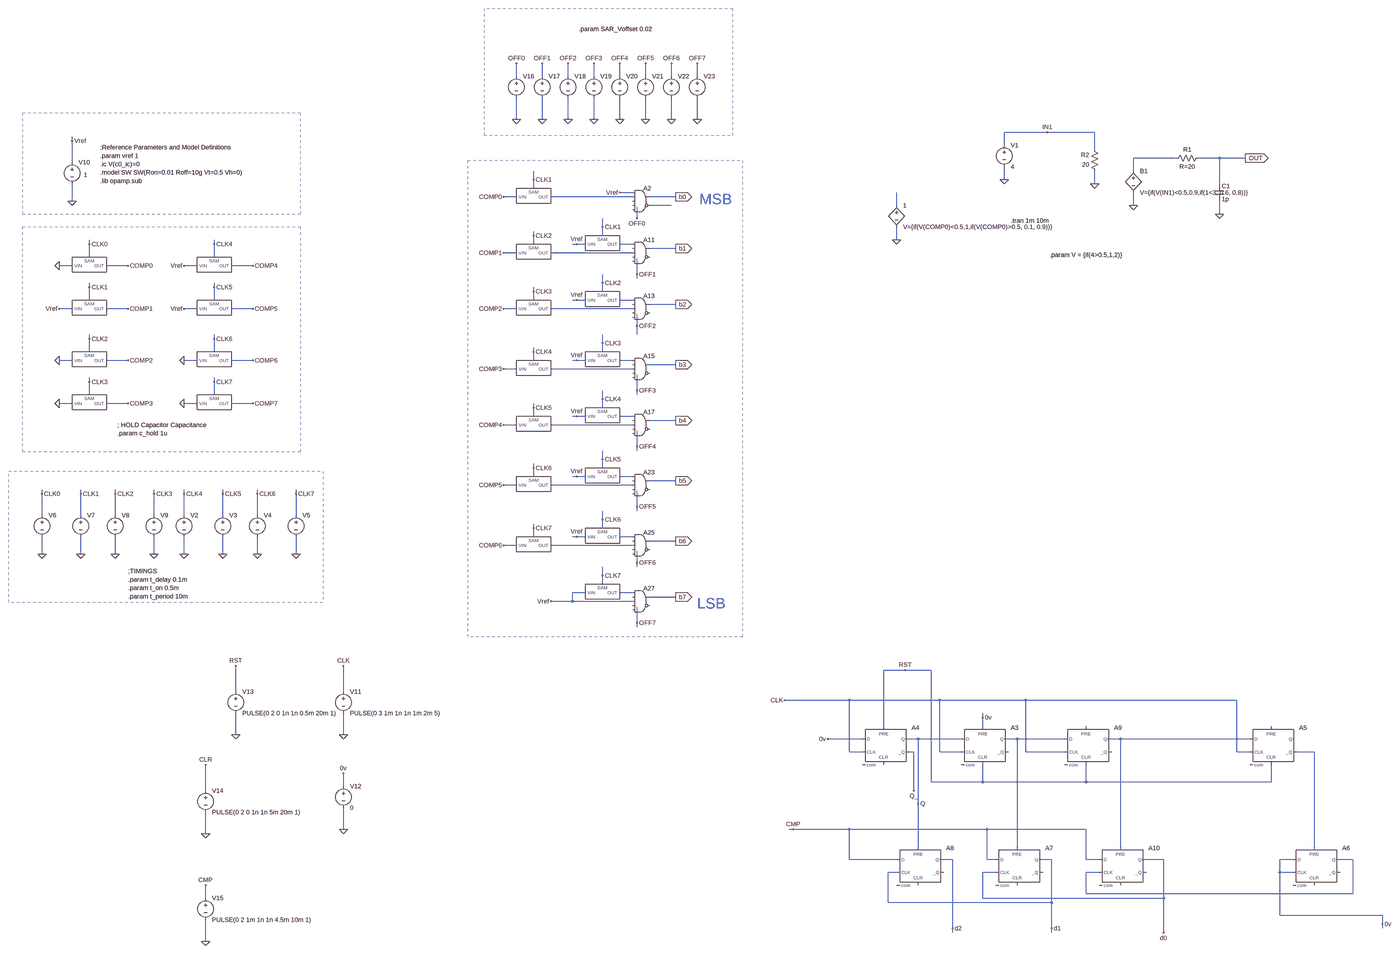
[diagram p0: schematic Draft2.asc, whole sheet]
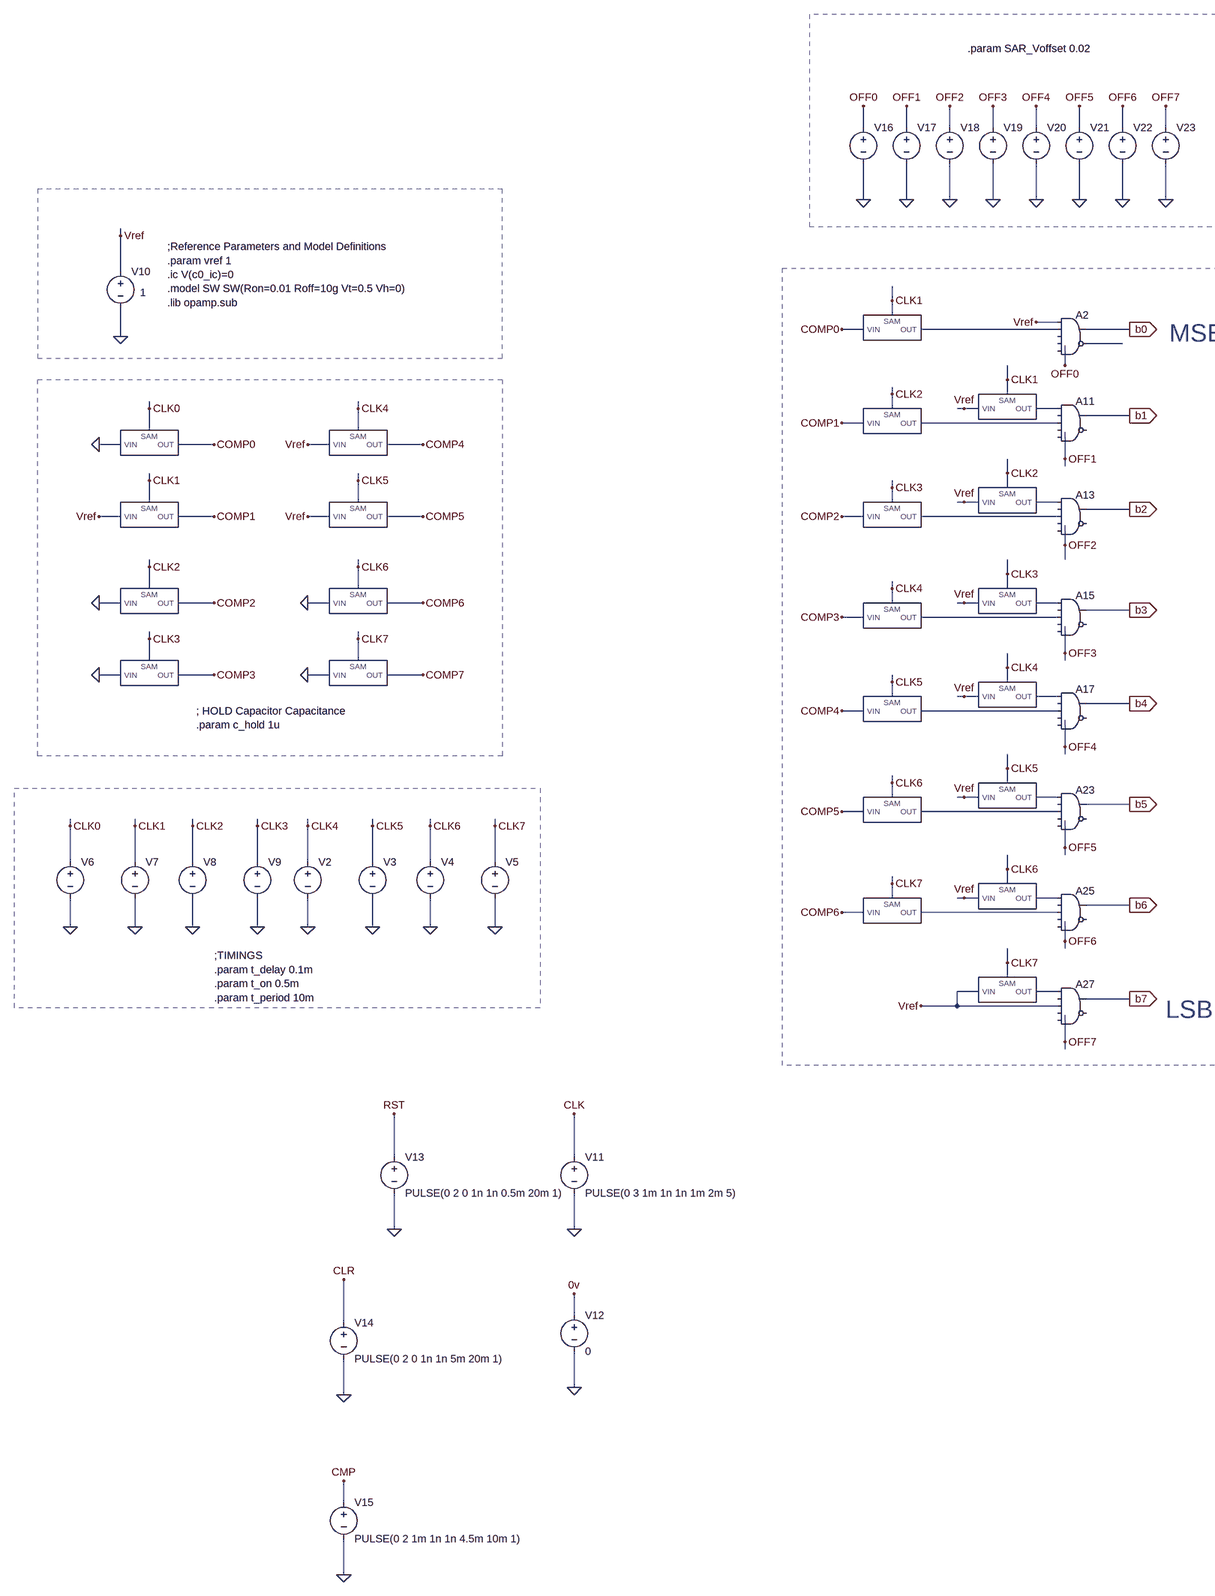
[diagram p1: schematic Draft2.asc, part, row 1 of 1, column 1 of 2]
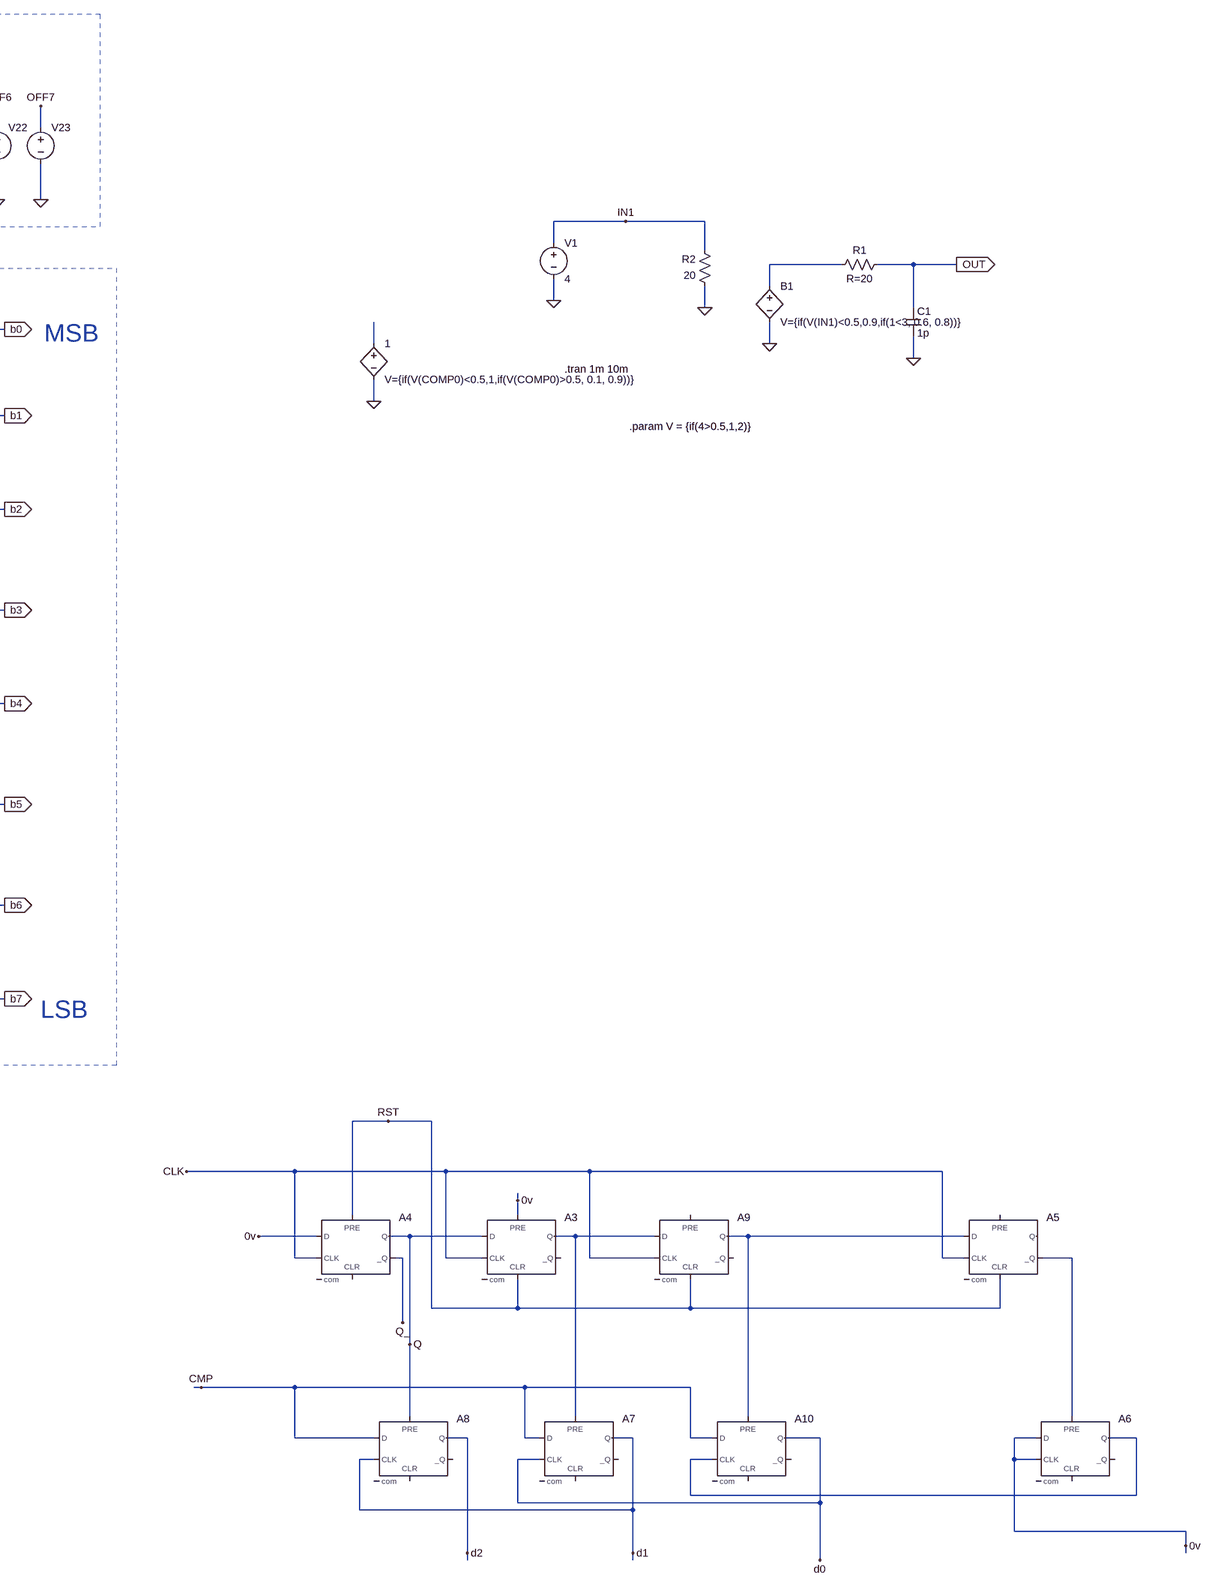
[diagram p2: schematic Draft2.asc, part, row 1 of 1, column 2 of 2]
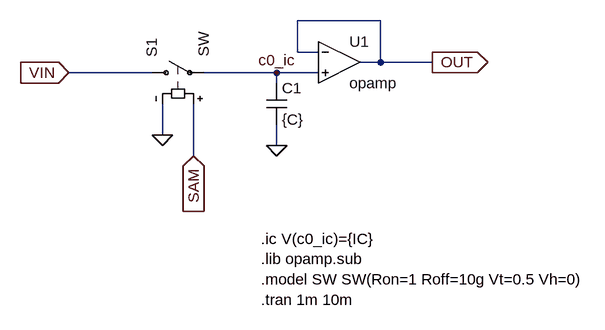
[diagram p3: sub-circuit com_sampleandhold.asc]
Draft2.asc, the LTspice schematic file:
Version 4
SHEET 1 4896 2624
WIRE 1312 -624 1312 -672
WIRE 1408 -624 1408 -672
WIRE 1504 -624 1504 -672
WIRE 1600 -624 1600 -672
WIRE 1696 -624 1696 -672
WIRE 1792 -624 1792 -672
WIRE 1888 -624 1888 -672
WIRE 1984 -624 1984 -672
WIRE 1312 -464 1312 -544
WIRE 1408 -464 1408 -544
WIRE 1504 -464 1504 -544
WIRE 1600 -464 1600 -544
WIRE 1696 -464 1696 -544
WIRE 1792 -464 1792 -544
WIRE 1888 -464 1888 -544
WIRE 1984 -464 1984 -544
WIRE 3568 -416 3408 -416
WIRE 3744 -416 3568 -416
WIRE -432 -384 -432 -400
WIRE 3408 -368 3408 -416
WIRE 3744 -352 3744 -416
WIRE 4048 -320 3888 -320
WIRE 4208 -320 4128 -320
WIRE 4304 -320 4208 -320
WIRE -432 -304 -432 -384
WIRE 3888 -272 3888 -320
WIRE 1376 -240 1376 -272
WIRE 3408 -240 3408 -288
WIRE 3744 -224 3744 -272
WIRE 4208 -224 4208 -320
WIRE 1376 -208 1376 -240
WIRE 1744 -192 1696 -192
WIRE 1312 -176 1264 -176
WIRE 1744 -176 1440 -176
WIRE 1904 -176 1808 -176
WIRE -432 -160 -432 -224
WIRE 1888 -144 1808 -144
WIRE 3008 -144 3008 -192
WIRE 3888 -144 3888 -192
WIRE 4208 -112 4208 -160
WIRE 1760 -96 1760 -128
WIRE 1632 -64 1632 -96
WIRE 1376 -32 1376 -48
WIRE 1632 -32 1632 -64
WIRE 3008 -16 3008 -64
WIRE -368 0 -368 -16
WIRE 96 0 96 -16
WIRE 1376 0 1376 -32
WIRE 1536 0 1520 0
WIRE 1568 0 1536 0
WIRE 1744 0 1696 0
WIRE 1904 16 1808 16
WIRE 1312 32 1264 32
WIRE 1744 32 1440 32
WIRE -368 48 -368 0
WIRE 96 48 96 0
WIRE -432 80 -480 80
WIRE -224 80 -304 80
WIRE 32 80 -16 80
WIRE 240 80 160 80
WIRE 1760 112 1760 64
WIRE 1760 128 1760 112
WIRE 1632 144 1632 112
WIRE -368 160 -368 144
WIRE 96 160 96 144
WIRE 1376 176 1376 160
WIRE 1632 176 1632 144
WIRE -368 208 -368 160
WIRE 96 208 96 160
WIRE 1376 208 1376 176
WIRE 1536 208 1520 208
WIRE 1568 208 1536 208
WIRE 1744 208 1696 208
WIRE 1904 224 1808 224
WIRE -432 240 -480 240
WIRE -224 240 -304 240
WIRE 32 240 -16 240
WIRE 240 240 160 240
WIRE 1312 240 1264 240
WIRE 1744 240 1440 240
WIRE 1760 304 1760 272
WIRE 1760 336 1760 304
WIRE -368 352 -368 336
WIRE 96 352 96 336
WIRE 1632 368 1632 336
WIRE -368 400 -368 352
WIRE 96 400 96 352
WIRE 1376 400 1376 384
WIRE 1632 400 1632 368
WIRE -432 432 -480 432
WIRE -224 432 -304 432
WIRE 32 432 -16 432
WIRE 240 432 160 432
WIRE 1376 432 1376 400
WIRE 1536 432 1520 432
WIRE 1568 432 1536 432
WIRE 1744 432 1696 432
WIRE 1904 448 1808 448
WIRE 1312 464 1264 464
WIRE 1744 464 1440 464
WIRE -368 512 -368 496
WIRE 96 512 96 496
WIRE 1760 544 1760 496
WIRE -368 560 -368 512
WIRE 96 560 96 512
WIRE 1760 560 1760 544
WIRE 1632 576 1632 544
WIRE -432 592 -480 592
WIRE -224 592 -304 592
WIRE 32 592 -16 592
WIRE 240 592 160 592
WIRE 1376 608 1376 592
WIRE 1632 608 1632 576
WIRE 1376 640 1376 608
WIRE 1536 640 1520 640
WIRE 1568 640 1536 640
WIRE 1744 640 1696 640
WIRE 1904 656 1808 656
WIRE 1312 672 1264 672
WIRE 1744 672 1440 672
WIRE 1760 752 1760 704
WIRE 1760 768 1760 752
WIRE 1632 800 1632 768
WIRE 1376 832 1376 816
WIRE 1632 832 1632 800
WIRE 1376 864 1376 832
WIRE 1536 864 1520 864
WIRE 1568 864 1536 864
WIRE 1744 864 1696 864
WIRE 1904 880 1808 880
WIRE 1312 896 1264 896
WIRE 1744 896 1440 896
WIRE -544 928 -544 912
WIRE -400 928 -400 912
WIRE -272 928 -272 912
WIRE -128 928 -128 912
WIRE -16 928 -16 912
WIRE 128 928 128 912
WIRE 256 928 256 912
WIRE 400 928 400 912
WIRE 1760 976 1760 928
WIRE 1760 992 1760 976
WIRE -544 1008 -544 928
WIRE -400 1008 -400 928
WIRE -272 1008 -272 928
WIRE -128 1008 -128 928
WIRE -16 1008 -16 928
WIRE 128 1008 128 928
WIRE 256 1008 256 928
WIRE 400 1008 400 928
WIRE 1632 1024 1632 992
WIRE 1376 1056 1376 1040
WIRE 1632 1056 1632 1024
WIRE 1376 1088 1376 1056
WIRE 1536 1088 1520 1088
WIRE 1568 1088 1536 1088
WIRE 1744 1088 1696 1088
WIRE 1904 1104 1808 1104
WIRE 1312 1120 1264 1120
WIRE 1744 1120 1440 1120
WIRE -544 1152 -544 1088
WIRE -400 1152 -400 1088
WIRE -272 1152 -272 1088
WIRE -128 1152 -128 1088
WIRE -16 1152 -16 1088
WIRE 128 1152 128 1088
WIRE 256 1152 256 1088
WIRE 400 1152 400 1088
WIRE 1760 1184 1760 1152
WIRE 1760 1200 1760 1184
WIRE 1632 1232 1632 1200
WIRE 1632 1264 1632 1232
WIRE 1568 1296 1520 1296
WIRE 1744 1296 1696 1296
WIRE 1904 1312 1808 1312
WIRE 1520 1328 1520 1296
WIRE 1520 1328 1440 1328
WIRE 1744 1328 1520 1328
WIRE 1760 1408 1760 1360
WIRE 1760 1424 1760 1408
WIRE 3040 1584 2960 1584
WIRE 3136 1584 3040 1584
WIRE 176 1664 176 1568
WIRE 576 1664 576 1568
WIRE 2832 1696 2592 1696
WIRE 3168 1696 2832 1696
WIRE 3488 1696 3168 1696
WIRE 4272 1696 3488 1696
WIRE 3328 1760 3328 1744
WIRE 2960 1792 2960 1584
WIRE 3328 1792 3328 1760
WIRE 176 1824 176 1744
WIRE 576 1824 576 1744
WIRE 2880 1840 2752 1840
WIRE 3088 1840 3040 1840
WIRE 3248 1840 3088 1840
WIRE 3456 1840 3408 1840
WIRE 3632 1840 3456 1840
WIRE 3840 1840 3792 1840
WIRE 4320 1840 3840 1840
WIRE 2832 1888 2832 1696
WIRE 2880 1888 2832 1888
WIRE 3072 1888 3056 1888
WIRE 3168 1888 3168 1696
WIRE 3248 1888 3168 1888
WIRE 3488 1888 3488 1696
WIRE 3632 1888 3488 1888
WIRE 4272 1888 4272 1696
WIRE 4320 1888 4272 1888
WIRE 4560 1888 4496 1888
WIRE 3136 2000 3136 1584
WIRE 3328 2000 3328 1936
WIRE 3328 2000 3136 2000
WIRE 3712 2000 3712 1936
WIRE 3712 2000 3328 2000
WIRE 4400 2000 4400 1936
WIRE 4400 2000 3712 2000
WIRE 576 2016 576 1968
WIRE 64 2032 64 1936
WIRE 3072 2032 3072 1888
WIRE 3088 2080 3088 1840
WIRE 576 2176 576 2096
WIRE 2624 2176 2608 2176
WIRE 2832 2176 2624 2176
WIRE 3344 2176 2832 2176
WIRE 3712 2176 3344 2176
WIRE 64 2192 64 2112
WIRE 3088 2240 3088 2080
WIRE 3456 2240 3456 1840
WIRE 3840 2240 3840 1840
WIRE 4560 2240 4560 1888
WIRE 2832 2288 2832 2176
WIRE 3008 2288 2832 2288
WIRE 3216 2288 3168 2288
WIRE 3344 2288 3344 2176
WIRE 3376 2288 3344 2288
WIRE 3584 2288 3536 2288
WIRE 3712 2288 3712 2176
WIRE 3760 2288 3712 2288
WIRE 4000 2288 3920 2288
WIRE 4480 2288 4432 2288
WIRE 4704 2288 4640 2288
WIRE 3008 2336 2976 2336
WIRE 3376 2336 3328 2336
WIRE 3760 2336 3712 2336
WIRE 4432 2336 4432 2288
WIRE 4480 2336 4432 2336
WIRE 3712 2416 3712 2336
WIRE 4704 2416 4704 2288
WIRE 4704 2416 3712 2416
WIRE 64 2432 64 2384
WIRE 3328 2432 3328 2336
WIRE 4000 2432 4000 2288
WIRE 4000 2432 3328 2432
WIRE 2976 2448 2976 2336
WIRE 3584 2448 3584 2288
WIRE 3584 2448 2976 2448
WIRE 4432 2496 4432 2336
WIRE 4880 2496 4432 2496
WIRE 4880 2528 4880 2496
WIRE 3216 2544 3216 2288
WIRE 3584 2544 3584 2448
WIRE 4880 2544 4880 2528
WIRE 3216 2560 3216 2544
WIRE 3584 2560 3584 2544
WIRE 4000 2560 4000 2432
WIRE 64 2592 64 2512
FLAG 3568 -416 IN1
FLAG 3888 -144 0
FLAG 4208 -112 0
FLAG 4304 -320 OUT
IOPIN 4304 -320 Out
FLAG 3408 -240 0
FLAG 3744 -224 0
FLAG -16 1152 0
FLAG -16 928 CLK4
FLAG 128 1152 0
FLAG 128 928 CLK5
FLAG 256 1152 0
FLAG 256 928 CLK6
FLAG 400 1152 0
FLAG 400 928 CLK7
FLAG -544 1152 0
FLAG -544 928 CLK0
FLAG -400 1152 0
FLAG -400 928 CLK1
FLAG -272 1152 0
FLAG -272 928 CLK2
FLAG -128 1152 0
FLAG -128 928 CLK3
FLAG -432 -160 0
FLAG -432 -384 Vref
FLAG -16 432 0
FLAG 96 352 CLK6
FLAG 240 432 COMP6
FLAG -16 592 0
FLAG 96 512 CLK7
FLAG 240 592 COMP7
FLAG -480 432 0
FLAG -368 352 CLK2
FLAG -224 432 COMP2
FLAG -480 592 0
FLAG -368 512 CLK3
FLAG -224 592 COMP3
FLAG -16 80 Vref
FLAG 96 0 CLK4
FLAG 240 80 COMP4
FLAG -16 240 Vref
FLAG 96 160 CLK5
FLAG 240 240 COMP5
FLAG -480 80 0
FLAG -368 0 CLK0
FLAG -224 80 COMP0
FLAG -480 240 Vref
FLAG -368 160 CLK1
FLAG -224 240 COMP1
FLAG 1904 -176 b0
IOPIN 1904 -176 Out
FLAG 1696 -192 Vref
FLAG 576 1824 0
FLAG 576 2176 0
FLAG 576 1968 0v
FLAG 2752 1840 0v
FLAG 576 1568 CLK
FLAG 2592 1696 CLK
FLAG 176 1824 0
FLAG 176 1568 RST
FLAG 3088 2080 Q
FLAG 3072 2032 Q_
FLAG 64 2192 0
FLAG 64 1936 CLR
FLAG 3040 1584 RST
FLAG 4880 2528 0v
FLAG 2624 2176 CMP
FLAG 64 2592 0
FLAG 64 2384 CMP
FLAG 3584 2544 d1
FLAG 3216 2544 d2
FLAG 3328 1760 0v
FLAG 4000 2560 d0
FLAG 1264 -176 COMP0
FLAG 1376 -240 CLK1
FLAG 3008 -16 0
FLAG 1904 16 b1
IOPIN 1904 16 Out
FLAG 1264 32 COMP1
FLAG 1376 -32 CLK2
FLAG 1632 -64 CLK1
FLAG 1904 224 b2
IOPIN 1904 224 Out
FLAG 1264 240 COMP2
FLAG 1376 176 CLK3
FLAG 1632 144 CLK2
FLAG 1904 448 b3
IOPIN 1904 448 Out
FLAG 1264 464 COMP3
FLAG 1376 400 CLK4
FLAG 1632 368 CLK3
FLAG 1904 656 b4
IOPIN 1904 656 Out
FLAG 1264 672 COMP4
FLAG 1376 608 CLK5
FLAG 1632 576 CLK4
FLAG 1904 880 b5
IOPIN 1904 880 Out
FLAG 1264 896 COMP5
FLAG 1376 832 CLK6
FLAG 1632 800 CLK5
FLAG 1904 1104 b6
IOPIN 1904 1104 Out
FLAG 1264 1120 COMP6
FLAG 1376 1056 CLK7
FLAG 1632 1024 CLK6
FLAG 1904 1312 b7
IOPIN 1904 1312 Out
FLAG 1632 1232 CLK7
FLAG 1536 0 Vref
FLAG 1536 208 Vref
FLAG 1536 432 Vref
FLAG 1536 640 Vref
FLAG 1536 864 Vref
FLAG 1536 1088 Vref
FLAG 1440 1328 Vref
FLAG 1312 -464 0
FLAG 1312 -672 OFF0
FLAG 1408 -464 0
FLAG 1408 -672 OFF1
FLAG 1504 -464 0
FLAG 1504 -672 OFF2
FLAG 1600 -464 0
FLAG 1600 -672 OFF3
FLAG 1696 -464 0
FLAG 1696 -672 OFF4
FLAG 1792 -464 0
FLAG 1792 -672 OFF5
FLAG 1888 -464 0
FLAG 1888 -672 OFF6
FLAG 1984 -464 0
FLAG 1984 -672 OFF7
FLAG 1760 -96 OFF0
FLAG 1760 112 OFF1
FLAG 1760 304 OFF2
FLAG 1760 544 OFF3
FLAG 1760 752 OFF4
FLAG 1760 976 OFF5
FLAG 1760 1184 OFF6
FLAG 1760 1408 OFF7
SYMBOL res 4144 -336 R90
WINDOW 0 0 56 VBottom 2
WINDOW 3 32 56 VTop 2
SYMATTR InstName R1
SYMATTR Value R=20
SYMBOL cap 4192 -224 R0
SYMATTR InstName C1
SYMATTR Value 1p
SYMBOL voltage 3408 -384 R0
SYMATTR InstName V1
SYMATTR Value 4
SYMBOL res 3760 -256 R180
WINDOW 0 36 76 Left 2
WINDOW 3 36 40 Left 2
SYMATTR InstName R2
SYMATTR Value 20
SYMBOL bv 3888 -288 R0
SYMATTR InstName B1
SYMATTR Value V={if(V(IN1)<0.5,0.9,if(1<3, 0.6, 0.8))}
SYMBOL voltage -16 992 R0
WINDOW 3 24 96 Invisible 2
SYMATTR Value PULSE(0 1 {t_delay+4*t_on} 1n 1n {t_on} {t_period} 1)
SYMATTR InstName V2
SYMBOL voltage 128 992 R0
WINDOW 3 24 96 Invisible 2
SYMATTR Value PULSE(0 1 {t_delay+5*t_on} 1n 1n {t_on} {t_period} 1)
SYMATTR InstName V3
SYMBOL voltage 256 992 R0
WINDOW 3 24 96 Invisible 2
SYMATTR Value PULSE(0 1 {t_delay+6*t_on} 1n 1n {t_on} {t_period} 1)
SYMATTR InstName V4
SYMBOL voltage 400 992 R0
WINDOW 3 24 96 Invisible 2
SYMATTR Value PULSE(0 1 {t_delay+7*t_on} 1n 1n {t_on} {t_period} 1)
SYMATTR InstName V5
SYMBOL voltage -544 992 R0
WINDOW 3 24 96 Invisible 2
SYMATTR Value PULSE(0 1 {t_delay} 1n 1n {t_on} {t_period} 1)
SYMATTR InstName V6
SYMBOL voltage -400 992 R0
WINDOW 3 24 96 Invisible 2
SYMATTR Value PULSE(0 1 {t_delay+t_on} 1n 1n {t_on} {t_period} 1)
SYMATTR InstName V7
SYMBOL voltage -272 992 R0
WINDOW 3 24 96 Invisible 2
SYMATTR Value PULSE(0 1 {t_delay+2*t_on} 1n 1n {t_on} {t_period} 1)
SYMATTR InstName V8
SYMBOL voltage -128 992 R0
WINDOW 3 24 96 Invisible 2
SYMATTR Value PULSE(0 1 {t_delay+3*t_on} 1n 1n {t_on} {t_period} 1)
SYMATTR InstName V9
SYMBOL voltage -432 -320 R0
WINDOW 3 50 62 Center 2
SYMATTR Value 1
SYMATTR InstName V10
SYMBOL COM_SampleAndHold 96 448 R0
WINDOW 0 0 -56 Invisible 2
WINDOW 39 0 0 Invisible 2
SYMATTR InstName X1
SYMBOL COM_SampleAndHold 96 608 R0
WINDOW 0 0 -56 Invisible 2
WINDOW 39 0 0 Invisible 2
SYMATTR InstName X2
SYMBOL COM_SampleAndHold -368 448 R0
WINDOW 0 0 -56 Invisible 2
WINDOW 39 0 0 Invisible 2
SYMATTR InstName X3
SYMBOL COM_SampleAndHold -368 608 R0
WINDOW 0 0 -56 Invisible 2
WINDOW 39 0 0 Invisible 2
SYMATTR InstName X4
SYMBOL COM_SampleAndHold 96 96 R0
WINDOW 0 0 -56 Invisible 2
WINDOW 39 0 0 Invisible 2
SYMATTR InstName X5
SYMBOL COM_SampleAndHold 96 256 R0
WINDOW 0 0 -56 Invisible 2
WINDOW 39 0 0 Invisible 2
SYMATTR InstName X6
SYMBOL COM_SampleAndHold -368 96 R0
WINDOW 0 0 -56 Invisible 2
WINDOW 39 0 0 Invisible 2
SYMATTR InstName X7
SYMBOL COM_SampleAndHold -368 256 R0
WINDOW 0 0 -56 Invisible 2
WINDOW 39 0 0 Invisible 2
SYMATTR InstName X8
SYMBOL Digital/and 1776 -224 R0
SYMATTR InstName A2
SYMBOL Digital/dflop 2960 1792 R0
SYMATTR InstName A4
SYMBOL voltage 576 1648 R0
SYMATTR InstName V11
SYMATTR Value PULSE(0 3 1m 1n 1n 1m 2m 5)
SYMBOL voltage 576 2000 R0
SYMATTR InstName V12
SYMATTR Value 0
SYMBOL voltage 176 1648 R0
SYMATTR InstName V13
SYMATTR Value PULSE(0 2 0 1n 1n 0.5m 20m 1)
SYMBOL voltage 64 2016 R0
SYMATTR InstName V14
SYMATTR Value PULSE(0 2 0 1n 1n 5m 20m 1)
SYMBOL Digital/dflop 3328 1792 R0
SYMATTR InstName A3
SYMBOL Digital/dflop 4400 1792 R0
SYMATTR InstName A5
SYMBOL Digital/dflop 4560 2240 R0
SYMATTR InstName A6
SYMBOL Digital/dflop 3456 2240 R0
SYMATTR InstName A7
SYMBOL Digital/dflop 3088 2240 R0
SYMATTR InstName A8
SYMBOL voltage 64 2416 R0
SYMATTR InstName V15
SYMATTR Value PULSE(0 2 1m 1n 1n 4.5m 10m 1)
SYMBOL Digital/dflop 3712 1792 R0
SYMATTR InstName A9
SYMBOL Digital/dflop 3840 2240 R0
SYMATTR InstName A10
SYMBOL COM_SampleAndHold 1376 -160 R0
WINDOW 0 0 -56 Invisible 2
WINDOW 39 0 0 Invisible 2
SYMATTR InstName X10
SYMATTR SpiceLine C=1u, IC=1
SYMBOL bv 3008 -160 R0
SYMATTR InstName 1
SYMATTR Value V={if(V(COMP0)<0.5,1,if(V(COMP0)>0.5, 0.1, 0.9))}
SYMBOL Digital/and 1776 -32 R0
SYMATTR InstName A11
SYMBOL COM_SampleAndHold 1632 16 R0
WINDOW 0 0 -56 Invisible 2
WINDOW 39 0 0 Invisible 2
SYMATTR InstName X12
SYMBOL COM_SampleAndHold 1376 48 R0
WINDOW 0 0 -56 Invisible 2
WINDOW 39 0 0 Invisible 2
SYMATTR InstName X13
SYMATTR SpiceLine C=1u, IC=1
SYMBOL Digital/and 1776 176 R0
SYMATTR InstName A13
SYMBOL COM_SampleAndHold 1632 224 R0
WINDOW 0 0 -56 Invisible 2
WINDOW 39 0 0 Invisible 2
SYMATTR InstName X17
SYMBOL COM_SampleAndHold 1376 256 R0
WINDOW 0 0 -56 Invisible 2
WINDOW 39 0 0 Invisible 2
SYMATTR InstName X18
SYMATTR SpiceLine C=1u, IC=1
SYMBOL Digital/and 1776 400 R0
SYMATTR InstName A15
SYMBOL COM_SampleAndHold 1632 448 R0
WINDOW 0 0 -56 Invisible 2
WINDOW 39 0 0 Invisible 2
SYMATTR InstName X19
SYMBOL COM_SampleAndHold 1376 480 R0
WINDOW 0 0 -56 Invisible 2
WINDOW 39 0 0 Invisible 2
SYMATTR InstName X20
SYMATTR SpiceLine C=1u, IC=1
SYMBOL Digital/and 1776 608 R0
SYMATTR InstName A17
SYMBOL COM_SampleAndHold 1632 656 R0
WINDOW 0 0 -56 Invisible 2
WINDOW 39 0 0 Invisible 2
SYMATTR InstName X21
SYMBOL COM_SampleAndHold 1376 688 R0
WINDOW 0 0 -56 Invisible 2
WINDOW 39 0 0 Invisible 2
SYMATTR InstName X22
SYMATTR SpiceLine C=1u, IC=1
SYMBOL Digital/and 1776 832 R0
SYMATTR InstName A23
SYMBOL COM_SampleAndHold 1632 880 R0
WINDOW 0 0 -56 Invisible 2
WINDOW 39 0 0 Invisible 2
SYMATTR InstName X23
SYMBOL COM_SampleAndHold 1376 912 R0
WINDOW 0 0 -56 Invisible 2
WINDOW 39 0 0 Invisible 2
SYMATTR InstName X24
SYMATTR SpiceLine C=1u, IC=1
SYMBOL Digital/and 1776 1056 R0
SYMATTR InstName A25
SYMBOL COM_SampleAndHold 1632 1104 R0
WINDOW 0 0 -56 Invisible 2
WINDOW 39 0 0 Invisible 2
SYMATTR InstName X25
SYMBOL COM_SampleAndHold 1376 1136 R0
WINDOW 0 0 -56 Invisible 2
WINDOW 39 0 0 Invisible 2
SYMATTR InstName X26
SYMATTR SpiceLine C=1u, IC=1
SYMBOL Digital/and 1776 1264 R0
SYMATTR InstName A27
SYMBOL COM_SampleAndHold 1632 1312 R0
WINDOW 0 0 -56 Invisible 2
WINDOW 39 0 0 Invisible 2
SYMATTR InstName X27
SYMBOL voltage 1312 -640 R0
WINDOW 3 24 96 Invisible 2
SYMATTR InstName V16
SYMATTR Value {0*SAR_Voffset}
SYMBOL voltage 1408 -640 R0
WINDOW 3 24 96 Invisible 2
SYMATTR InstName V17
SYMATTR Value {1*SAR_Voffset}
SYMBOL voltage 1504 -640 R0
WINDOW 3 24 96 Invisible 2
SYMATTR InstName V18
SYMATTR Value {2*SAR_Voffset}
SYMBOL voltage 1600 -640 R0
WINDOW 3 24 96 Invisible 2
SYMATTR InstName V19
SYMATTR Value {3*SAR_Voffset}
SYMBOL voltage 1696 -640 R0
WINDOW 3 24 96 Invisible 2
SYMATTR InstName V20
SYMATTR Value {4*SAR_Voffset}
SYMBOL voltage 1792 -640 R0
WINDOW 3 24 96 Invisible 2
SYMATTR InstName V21
SYMATTR Value {5*SAR_Voffset}
SYMBOL voltage 1888 -640 R0
WINDOW 3 24 96 Invisible 2
SYMATTR InstName V22
SYMATTR Value {6*SAR_Voffset}
SYMBOL voltage 1984 -640 R0
WINDOW 3 24 96 Invisible 2
SYMATTR InstName V23
SYMATTR Value {7*SAR_Voffset}
TEXT 3432 -88 Left 2 !.tran 1m 10m
TEXT 3576 40 Left 2 !.param V = {if(4>0.5,1,2)}
TEXT -224 1216 Left 2 !;TIMINGS\n.param t_delay 0.1m\n.param t_on 0.5m\n.param t_period 10m
TEXT -264 672 Left 2 !; HOLD Capacitor Capacitance\n.param c_hold 1u
TEXT 1544 -800 Left 2 !.param SAR_Voffset 0.02
TEXT 1992 -168 Left 5 ;MSB
TEXT 1984 1336 Left 5 ;LSB
TEXT -328 -360 Left 2 !;Reference Parameters and Model Definitions\n.param vref 1\n.ic V(c0_ic)=0\n.model SW SW(Ron=0.01 Roff=10g Vt=0.5 Vh=0)\n.lib opamp.sub
RECTANGLE Normal -668 844 500 1332 2
RECTANGLE Normal 416 772 -616 -64 2
RECTANGLE Normal 1132 -312 2152 1460 2
RECTANGLE Normal 1192 -404 2116 -876 2
RECTANGLE Normal -616 -112 416 -488 2

com_sampleandhold.asc, the sub-circuit schematic file:
Version 4
SHEET 1 880 680
WIRE 496 192 368 192
WIRE 368 240 368 192
WIRE 400 240 368 240
WIRE 496 256 496 192
WIRE 496 256 464 256
WIRE 576 256 496 256
WIRE 144 272 16 272
WIRE 336 272 224 272
WIRE 400 272 336 272
WIRE 336 288 336 272
WIRE 160 368 160 320
WIRE 336 384 336 352
WIRE 208 400 208 320
FLAG 336 384 0
FLAG 160 368 0
FLAG 576 256 OUT
IOPIN 576 256 Out
FLAG 208 400 SAM
IOPIN 208 400 In
FLAG 16 272 VIN
IOPIN 16 272 In
FLAG 336 272 c0_ic
SYMBOL Opamps/opamp 432 192 R0
SYMATTR InstName U1
SYMATTR SpiceLine Aol=1000K
SYMATTR SpiceLine2 GBW=10000Meg
SYMBOL sw 128 272 R270
SYMATTR InstName S1
SYMBOL cap 320 288 R0
SYMATTR InstName C1
SYMATTR Value {C}
TEXT 312 528 Left 2 !.ic V(c0_ic)={IC}\n.lib opamp.sub\n.model SW SW(Ron=1 Roff=10g Vt=0.5 Vh=0)\n.tran 1m 10m

The netlist it stands for:
* Draft2.asc
R1 OUT N001 R=20
C1 OUT 0 1p
V1 IN1 0 4
R2 0 IN1 20
B1 N001 0 V={if(V(IN1)<0.5,0.9,if(1<3, 0.6, 0.8))}
V2 CLK4 0 PULSE(0 1 {t_delay+4*t_on} 1n 1n {t_on} {t_period} 1)
V3 CLK5 0 PULSE(0 1 {t_delay+5*t_on} 1n 1n {t_on} {t_period} 1)
V4 CLK6 0 PULSE(0 1 {t_delay+6*t_on} 1n 1n {t_on} {t_period} 1)
V5 CLK7 0 PULSE(0 1 {t_delay+7*t_on} 1n 1n {t_on} {t_period} 1)
V6 CLK0 0 PULSE(0 1 {t_delay} 1n 1n {t_on} {t_period} 1)
V7 CLK1 0 PULSE(0 1 {t_delay+t_on} 1n 1n {t_on} {t_period} 1)
V8 CLK2 0 PULSE(0 1 {t_delay+2*t_on} 1n 1n {t_on} {t_period} 1)
V9 CLK3 0 PULSE(0 1 {t_delay+3*t_on} 1n 1n {t_on} {t_period} 1)
V10 Vref 0 1
XX1 CLK6 0 COMP6 com_sampleandhold params: C=1u, IC=0
XX2 CLK7 0 COMP7 com_sampleandhold params: C=1u, IC=0
XX3 CLK2 0 COMP2 com_sampleandhold params: C=1u, IC=0
XX4 CLK3 0 COMP3 com_sampleandhold params: C=1u, IC=0
XX5 CLK4 Vref COMP4 com_sampleandhold params: C=1u, IC=0
XX6 CLK5 Vref COMP5 com_sampleandhold params: C=1u, IC=0
XX7 CLK0 0 COMP0 com_sampleandhold params: C=1u, IC=0
XX8 CLK1 Vref COMP1 com_sampleandhold params: C=1u, IC=0
A2 Vref N002 OFF0 OFF0 OFF0 N003 b0 OFF0 AND
A4 0v 0 CLK RST 0 Q_ Q 0 DFLOP
V11 CLK 0 PULSE(0 3 1m 1n 1n 1m 2m 5)
V12 0v 0 0
V13 RST 0 PULSE(0 2 0 1n 1n 0.5m 20m 1)
V14 CLR 0 PULSE(0 2 0 1n 1n 5m 20m 1)
A3 Q 0 CLK 0v RST 0 N018 0 DFLOP
A5 N019 0 CLK 0 RST N020 0 0 DFLOP
A6 0v 0 0v N020 0 0 N021 0 DFLOP
A7 CMP 0 d0 N018 0 0 d1 0 DFLOP
A8 CMP 0 d1 Q 0 0 d2 0 DFLOP
V15 CMP 0 PULSE(0 2 1m 1n 1n 4.5m 10m 1)
A9 N018 0 CLK 0 RST 0 N019 0 DFLOP
A10 CMP 0 N021 N019 0 0 d0 0 DFLOP
XX10 CLK1 COMP0 N002 com_sampleandhold params: C=1u, IC=1
B§1 N004 0 V={if(V(COMP0)<0.5,1,if(V(COMP0)>0.5, 0.1, 0.9))}
A11 N005 OFF1 N006 OFF1 OFF1 OFF1 b1 OFF1 AND
XX12 CLK1 Vref N005 com_sampleandhold params: C=1u, IC=0
XX13 CLK2 COMP1 N006 com_sampleandhold params: C=1u, IC=1
A13 N007 OFF2 N008 OFF2 OFF2 OFF2 b2 OFF2 AND
XX17 CLK2 Vref N007 com_sampleandhold params: C=1u, IC=0
XX18 CLK3 COMP2 N008 com_sampleandhold params: C=1u, IC=1
A15 N009 OFF3 N010 OFF3 OFF3 OFF3 b3 OFF3 AND
XX19 CLK3 Vref N009 com_sampleandhold params: C=1u, IC=0
XX20 CLK4 COMP3 N010 com_sampleandhold params: C=1u, IC=1
A17 N011 OFF4 N012 OFF4 OFF4 OFF4 b4 OFF4 AND
XX21 CLK4 Vref N011 com_sampleandhold params: C=1u, IC=0
XX22 CLK5 COMP4 N012 com_sampleandhold params: C=1u, IC=1
A23 N013 OFF5 N014 OFF5 OFF5 OFF5 b5 OFF5 AND
XX23 CLK5 Vref N013 com_sampleandhold params: C=1u, IC=0
XX24 CLK6 COMP5 N014 com_sampleandhold params: C=1u, IC=1
A25 N015 OFF6 N016 OFF6 OFF6 OFF6 b6 OFF6 AND
XX25 CLK6 Vref N015 com_sampleandhold params: C=1u, IC=0
XX26 CLK7 COMP6 N016 com_sampleandhold params: C=1u, IC=1
A27 N017 OFF7 Vref OFF7 OFF7 OFF7 b7 OFF7 AND
XX27 CLK7 Vref N017 com_sampleandhold params: C=1u, IC=0
V16 OFF0 0 {0*SAR_Voffset}
V17 OFF1 0 {1*SAR_Voffset}
V18 OFF2 0 {2*SAR_Voffset}
V19 OFF3 0 {3*SAR_Voffset}
V20 OFF4 0 {4*SAR_Voffset}
V21 OFF5 0 {5*SAR_Voffset}
V22 OFF6 0 {6*SAR_Voffset}
V23 OFF7 0 {7*SAR_Voffset}

* block symbol definitions
.subckt com_sampleandhold SAM VIN OUT
XU1 OUT c0_ic OUT opamp Aol=1000K GBW=10000Meg  ; pins invin noninvin out
S1 VIN c0_ic SAM 0 SW
C1 c0_ic 0 {C}
.ic V(c0_ic)={IC}
.lib opamp.sub
.model SW SW(Ron=1 Roff=10g Vt=0.5 Vh=0)
.tran 1m 10m
.ends com_sampleandhold

.tran 1m 10m
.param V = {if(4>0.5,1,2)}
;TIMINGS
.param t_delay 0.1m
.param t_on 0.5m
.param t_period 10m
; HOLD Capacitor Capacitance
.param c_hold 1u
.param SAR_Voffset 0.02
* MSB
* LSB
;Reference Parameters and Model Definitions
.param vref 1
.ic V(c0_ic)=0
.model SW SW(Ron=0.01 Roff=10g Vt=0.5 Vh=0)
.lib opamp.sub
.backanno
.end